# Altium schematic sheet 2017-07-30_02-04-411.schdoc
size 424 x 127 mm; SheetNumber: 1; SheetTotal: 1
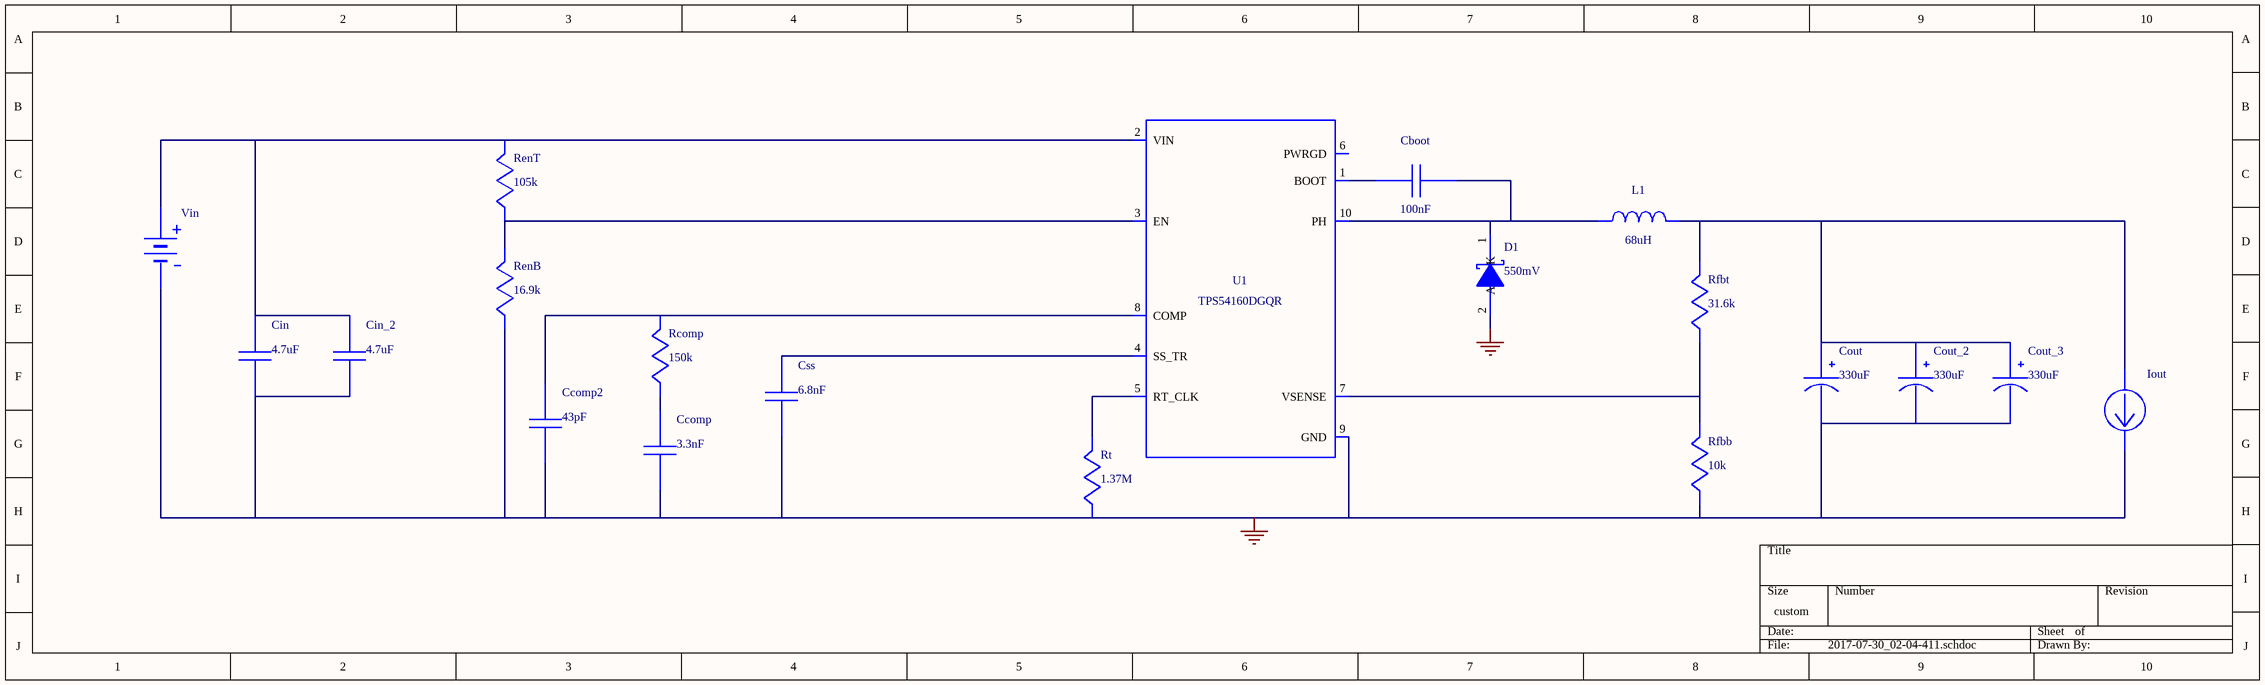
[diagram p0: 2017-07-30_02-04-411.schdoc]

## Parts
Cboot  value 100nF  (hidden comment: GRM155R61A104KA01D)
Ccomp  value 3.3nF  (hidden comment: GRM033R61A332KA01D)
Ccomp2  value 43pF  (hidden comment: CL21C430JBANNNC)
Cin  value 4.7uF  (hidden comment: GRM21BR61E475MA12L)
Cin_2  value 4.7uF  (hidden comment: GRM21BR61E475MA12L)
Cout  value 330uF  (hidden comment: T495D337K006ATE050)
Cout_2  value 330uF  (hidden comment: T495D337K006ATE050)
Cout_3  value 330uF  (hidden comment: T495D337K006ATE050)
Css  value 6.8nF  (hidden comment: CC0805KRX7R9BB682)
D1  value 550mV  (hidden comment: SS24FL)
Iout  WB_CURRENT_LOAD  (value not drawn)
L1  value 68uH  (hidden comment: PM2110-680K-RC)
Rcomp  value 150k  (hidden comment: CRCW0402150KFKED)
RenB  value 16.9k  (hidden comment: CRCW040216K9FKED)
RenT  value 105k  (hidden comment: CRCW0402105KFKED)
Rfbb  value 10k  (hidden comment: CRCW040210K0FKED)
Rfbt  value 31.6k  (hidden comment: CRCW040231K6FKED)
Rt  value 1.37M  (hidden comment: CRCW04021M37FKED)
U1  TPS54140DGQR  (value not drawn)
Vin  WB_BATTERY  (value not drawn)

## Nets
0: Ccomp.2 Ccomp2.2 Cin.2 Cin_2.2 Cout.2(-) Cout_2.2(-) Cout_3.2(-) Css.2 D1.2(A) Iout.2(-) RenB.2 Rfbb.2 Rt.2 U1.9(GND) U1.11(EPAD) Vin.2(-)
NetCboot_1: Cboot.1 U1.1(BOOT)
NetCboot_2: Cboot.2 D1.1(K) L1.2 U1.10(PH)
NetCcomp2_1: Ccomp2.1 Rcomp.1 U1.8(COMP)
NetCcomp_1: Ccomp.1 Rcomp.2
NetCin_1: Cin.1 Cin_2.1 RenT.1 U1.2(VIN) Vin.1(+)
NetCout_1: Cout.1(+) Cout_2.1(+) Cout_3.1(+) Iout.1(+) L1.1 Rfbt.1
NetCss_1: Css.1 U1.4(SS_TR)
NetRenB_1: RenB.1 RenT.2 U1.3(EN)
NetRfbb_1: Rfbb.1 Rfbt.2 U1.7(VSENSE)
NetRt_1: Rt.1 U1.5(RT_CLK)

Not connected (* = marked no-connect by the designer): U1 6(PWRGD)

## Library data of the parts
Cboot = GRM155R61A104KA01D: GRM155R61A104KA0; Manufacturer Name: MuRata; PackageReference: GRM155R61A104KA01D; Manufacturer Part Number: GRM155R61A104KA01D
Ccomp = GRM033R61A332KA01D: GRM033R61A332KA0; Manufacturer Name: MuRata; PackageReference: GRM033R61A332KA01D; Manufacturer Part Number: GRM033R61A332KA01D
Ccomp2 = CL21C430JBANNNC: Manufacturer Name: Samsung Electro-Mechanics; PackageReference: CL21C430JBANNNC; Manufacturer Part Number: CL21C430JBANNNC
Cin Cin_2 = GRM21BR61E475MA12L: GRM21BR61E475MA1; Manufacturer Name: MuRata; PackageReference: GRM21BR61E475MA12L; Manufacturer Part Number: GRM21BR61E475MA12L
Cout Cout_2 Cout_3 = T495D337K006ATE050: T495D337K006ATE0; Manufacturer Name: Kemet; PackageReference: T495D337K006ATE050; Manufacturer Part Number: T495D337K006ATE050
Css = CC0805KRX7R9BB682: CC0805KRX7R9BB68; Manufacturer Name: Yageo America; PackageReference: CC0805KRX7R9BB682; Manufacturer Part Number: CC0805KRX7R9BB682
D1 = SS24FL: Manufacturer Name: Fairchild Semiconductor; PackageReference: SS24FL; Manufacturer Part Number: SS24FL
L1 = PM2110-680K-RC: Manufacturer Name: Bourns; PackageReference: PM2110-680K-RC; Manufacturer Part Number: PM2110-680K-RC
Rcomp = CRCW0402150KFKED: Manufacturer Name: Vishay-Dale; PackageReference: CRCW0402150KFKED; Manufacturer Part Number: CRCW0402150KFKED
RenB = CRCW040216K9FKED: Manufacturer Name: Vishay-Dale; PackageReference: CRCW040216K9FKED; Manufacturer Part Number: CRCW040216K9FKED
RenT = CRCW0402105KFKED: Manufacturer Name: Vishay-Dale; PackageReference: CRCW0402105KFKED; Manufacturer Part Number: CRCW0402105KFKED
Rfbb = CRCW040210K0FKED: Manufacturer Name: Vishay-Dale; PackageReference: CRCW040210K0FKED; Manufacturer Part Number: CRCW040210K0FKED
Rfbt = CRCW040231K6FKED: Manufacturer Name: Vishay-Dale; PackageReference: CRCW040231K6FKED; Manufacturer Part Number: CRCW040231K6FKED
Rt = CRCW04021M37FKED: Manufacturer Name: Vishay-Dale; PackageReference: CRCW04021M37FKED; Manufacturer Part Number: CRCW04021M37FKED
U1 = TPS54140DGQR: TPS54160DGQR; Manufacturer Name: Texas Instruments; PackageReference: TPS54160DGQR; Manufacturer Part Number: TPS54140DGQR; Value: N/A
Iout = WB_CURRENT_LOAD: PackageReference: WB_CURRENT_LOAD; Manufacturer Part Number: WB_CURRENT_LOAD; Manufacturer Name: WB_CURRENT_LOAD; Value: N/A
Vin = WB_BATTERY: PackageReference: WB_BATTERY; Manufacturer Part Number: WB_BATTERY; Manufacturer Name: WB_BATTERY; Value: N/A